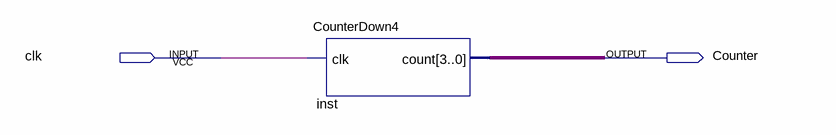
[diagram p0: schematic sheet]
// Quartus schematic CounterDown4.bdf as structural Verilog: 1 symbols, 2 pins
module CounterDown4 (
  input  clk,
  output Counter
);

  wire [3:0] inst_count;

  CounterDown4 inst (.clk(clk), .count(inst_count));
endmodule
